# EAGLE design SparkFun_Pressure_Sensor_BMP581_Qwiic (EAGLE 9.6.2)
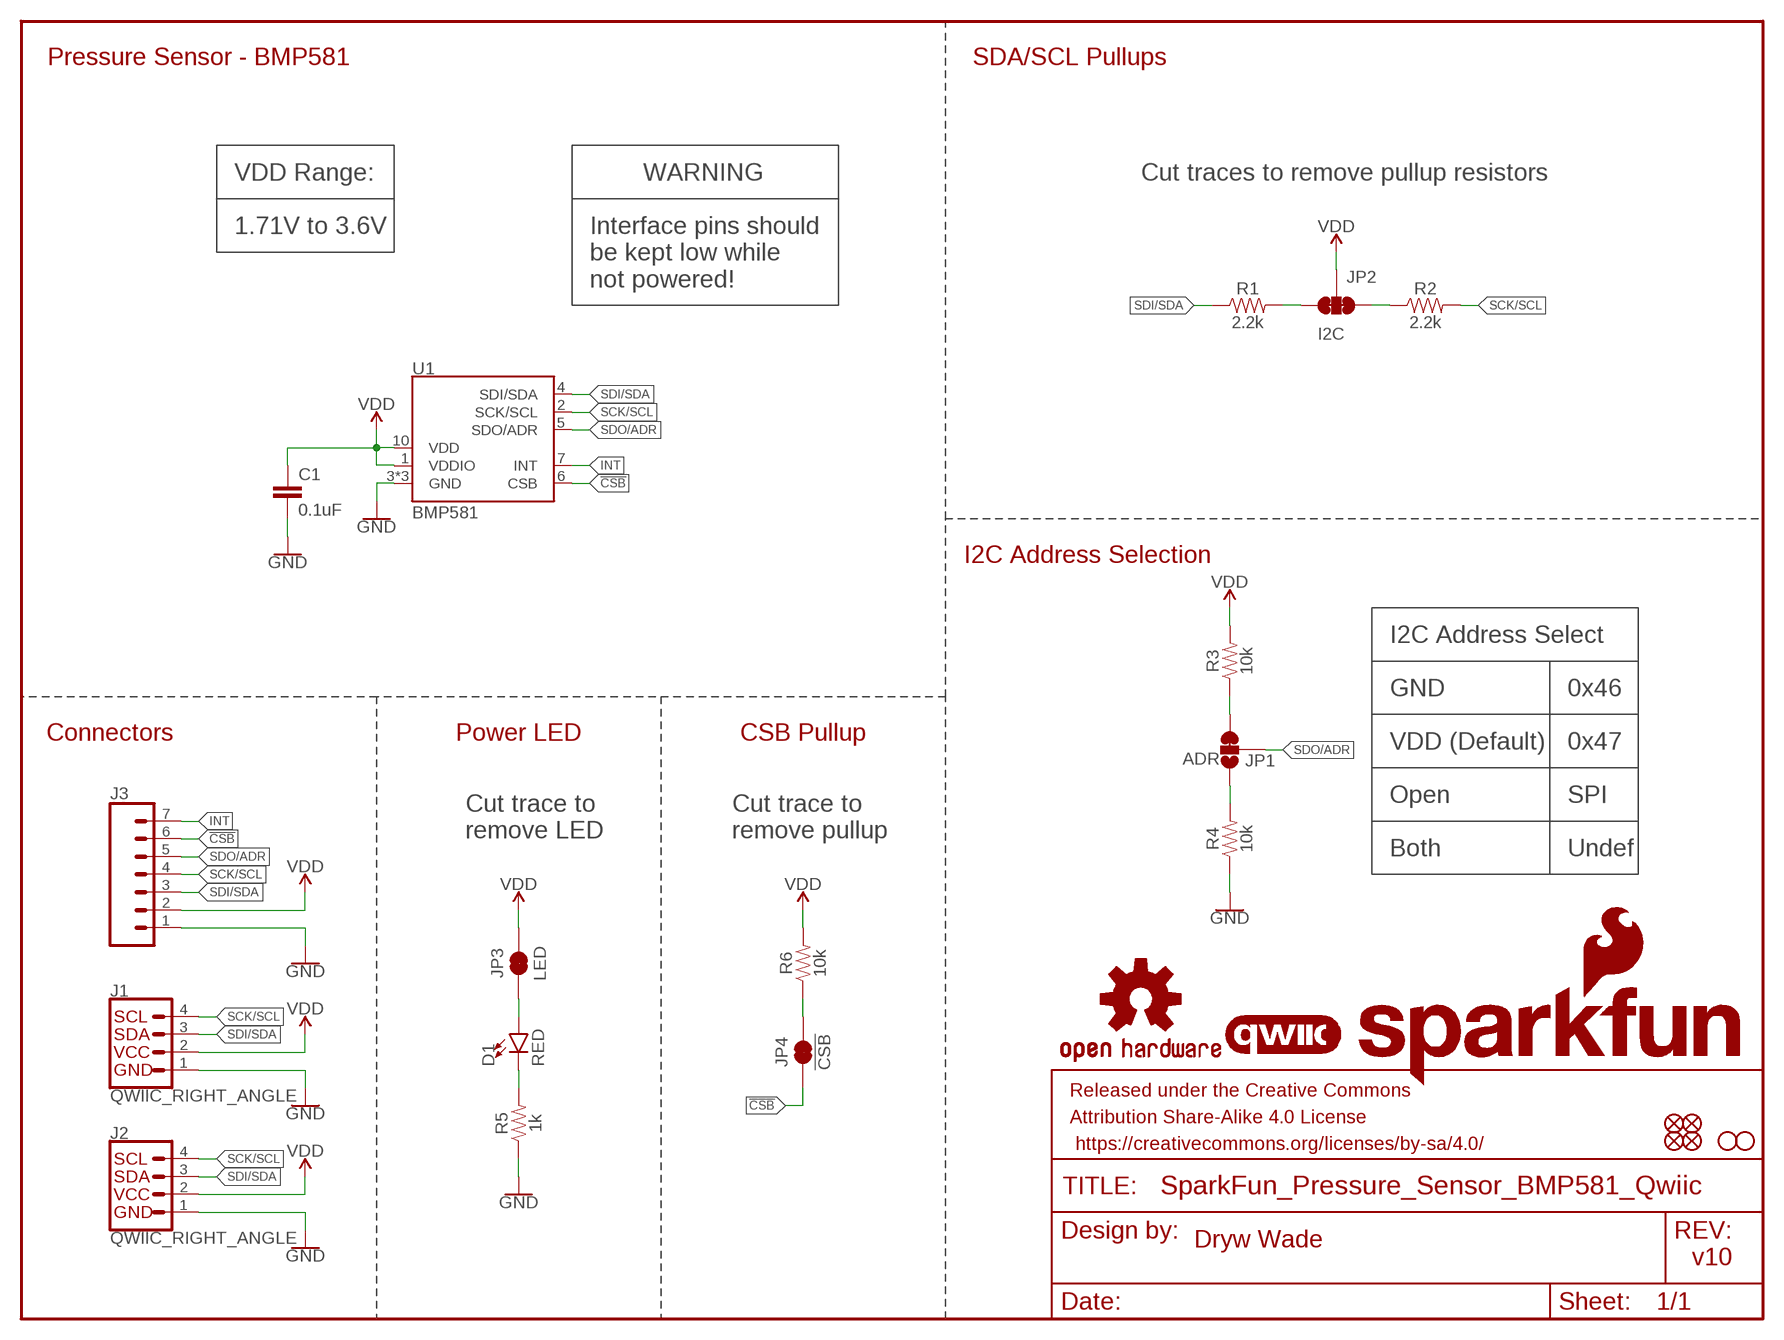
[diagram p0: schematic, sheet 1]

## Parts
C1  0.1uF  0.1UF-0603-25V-(+80/-20%)  [0603]
D1  RED  LED-RED0603  [LED-0603]
FD1  FIDUCIAL1X2  [FIDUCIAL-1X2]
FD2  FIDUCIAL1X2  [FIDUCIAL-1X2]
FD3  FIDUCIAL1X2  [FIDUCIAL-1X2]
FD4  FIDUCIAL1X2  [FIDUCIAL-1X2]
FRAME1  FRAME-LETTER  [CREATIVE_COMMONS]
H1  STAND-OFF  [STAND-OFF]
H2  STAND-OFF  [STAND-OFF]
J1  QWIIC_RIGHT_ANGLE  QWIIC_CONNECTORJS-1MM  [JST04_1MM_RA]
J2  QWIIC_RIGHT_ANGLE  QWIIC_CONNECTORJS-1MM  [JST04_1MM_RA]
J3  CONN_07NO_SILK  [1X07_NO_SILK]
JP1  ADR  JUMPER-SMT_3_1-NC_TRACE_SILK  [SMT-JUMPER_3_1-NC_TRACE_SILK]
JP2  I2C  JUMPER-SMT_3_2-NC_TRACE_SILK  [SMT-JUMPER_3_2-NC_TRACE_SILK]
JP3  LED  JUMPER-SMT_2_NC_TRACE_SILK  [SMT-JUMPER_2_NC_TRACE_SILK]
JP4  !CSB!  JUMPER-SMT_2_NC_TRACE_SILK  [SMT-JUMPER_2_NC_TRACE_SILK]
LOGO1  OSHW-LOGOS  [OSHW-LOGO-S]
LOGO2  SFE_LOGO_FLAME.2_INCH  [SFE_LOGO_FLAME_.2]
LOGO3  QWIIC_LOGO_5MM  [QWIIC_5MM]
LOGO4  SFE_LOGO_NAME_FLAME.1_INCH  [SFE_LOGO_NAME_FLAME_.1]
R1  2.2k  2.2KOHM-0603-1/10W-1%  [0603]
R2  2.2k  2.2KOHM-0603-1/10W-1%  [0603]
R3  10k  10KOHM-0603-1/10W-1%  [0603]
R4  10k  10KOHM-0603-1/10W-1%  [0603]
R5  1k  1KOHM-0603-1/10W-1%  [0603]
R6  10k  10KOHM-0603-1/10W-1%  [0603]
U1  BMP581  [BMP581]

## Nets
!CSB!: J3.6 JP4.1 U1.6(CSB)
GND: C1.2 J1.1 J2.1 J3.1 R4.1 R5.1 U1.3(GND) U1.8(GND) U1.9(GND)
INT: J3.7 U1.7(INT)
N$1: JP1.3 R3.1
N$2: JP1.1 R4.2
N$3: JP2.1 R2.1
N$4: JP2.3 R1.2
N$5: D1.A JP3.1
N$6: D1.C R5.2
N$7: JP4.2 R6.1
SCK/SCL: J1.4 J2.4 J3.4 R2.2 U1.2(SCK/SCL)
SDI/SDA: J1.3 J2.3 J3.3 R1.1 U1.4(SDI/SDA)
SDO/ADR: J3.5 JP1.2 U1.5(SDO/ADR)
VDD: C1.1 J1.2 J2.2 J3.2 JP2.2 JP3.2 R3.2 R6.2 U1.1(VDDIO) U1.10(VDD)

## Notes on the sheet
- Pressure Sensor - BMP581 | SDA/SCL Pullups
- VDD Range: | WARNING | Cut traces to remove pullup resistors
- 1.71V to 3.6V
- Interface pins should
  be kept low while
  not powered!
- I2C Address Selection
- I2C Address Select
- GND | 0x46
- Connectors | Power LED | CSB Pullup
- VDD (Default) | 0x47
- Open | SPI
- Cut trace to
  remove LED
- Cut trace to
  remove pullup
- Both | Undef
- Dryw Wade
- v10

## Library data of the parts
C1 = SparkFun-Capacitors:0.1UF: 0.1µF ceramic capacitors A capacitor is a passive two-terminal electrical component used to store electrical energy temporarily in an electric field.; PROD_ID: CAP-00810
D1 = SparkFun-LED:LED-RED: Red SMD LED Used in manufacturing of most products at SparkFun Packages: 0603 - SMD 0603 package [Product Link] <http://docs.avagotech.com/docs/AV02-0551EN> 0603 SMART - SMD 0603 SMART package ( more efficient and expensive)[Product Link] <http://www.osram-os.com/Graphics/XPic2/00077099_0.pdf> 1206 - SMD1206 package [Product Link] <https://www.sparkfun.com/datasheets/DevTools/LilyPad/Q150OVS4.pdff> SparkFun Products: Pro Mini 328 -5V <https://www.sparkfun.com/products/821> RedBoard <https://www.sparkfun.com/products/12757> IOIO-OTG <https://www.sparkfun.com/products/13613>; PROD_ID: DIO-00819
FD1-FD4 = SparkFun-Aesthetics:FIDUCIAL: Fiducial Alignment Points Point-of-reference for pick-and-place machines and other optical instruments.
FRAME1 = SparkFun-Aesthetics:FRAME-LETTER: Schematic Frame - Letter Standard 8.5x11 US Letter frame
H1 H2 = SparkFun-Hardware:STAND-OFF: Stand Off Drill holes for mechanically mounting via screws, standoffs, etc. Note: Use the keepout ring to avoid running the screw head into surrounding components. Variant Overviews STAND-OFF - Mechanical footprint for a #4 phillips button head screw. STAND-OFF-TIGHT - Mechanical footprint for a #4 phillips button head screw, Example SparkFun Products Screw - Phillips Head (1/4", 4-40, 10 pack) <https://www.sparkfun.com/products/10453> (PRT-10453) Screw - Phillips Head (1/2", 4-40, 10 pack) <https://www.sparkfun.com/products/10452> (PRT-10452) Screw - Phillips Head (3/4", 4-40, 10 pack) <https://www.sparkfun.com/products/10451> (PRT-10451) Screw - Phillips Head (1", 4-40, 10 pack) <https://www.sparkfun.com/products/10450> (PRT-10450)
J1 J2 = SparkFun-Connectors:QWIIC_CONNECTOR: SparkFun I2C Standard Qwiic Connector An SMD 1mm pitch JST connector makes it easy and quick (get it? Qwiic?) to connect I2C devices to each other. The Qwiic system <http://www.sparkfun.com/qwiic> enables fast and solderless connection between popular platforms and various sensors and actuators. We carry 200mm <https://www.sparkfun.com/products/14204>, 100mm <https://www.sparkfun.com/products/14205>, 50mm <https://www.sparkfun.com/products/14206>, and breadboard friendly <https://www.sparkfun.com/products/14207> Qwiic cables. We also offer 10 pcs strips <https://www.sparkfun.com/products/14323> the SMD connectors.; PROD_ID: CONN-13694
J3 = SparkFun-Connectors:CONN_07: Multi connection point. Often used as Generic Header-pin footprint for 0.1 inch spaced/style header connections On any of the 0.1 inch spaced packages, you can populate with these: Break Away Headers - Straight <https://www.sparkfun.com/products/116> (PRT-00116) Break Away Male Headers - Right Angle <https://www.sparkfun.com/products/553> (PRT-00553) Female Headers <https://www.sparkfun.com/products/115> (PRT-00115) Break Away Headers - Machine Pin <https://www.sparkfun.com/products/117> (PRT-00117) Break Away Female Headers - Swiss Machine Pin <https://www.sparkfun.com/products/743> (PRT-00743) For SCREWTERMINALS and SPRING TERMINALS visit here: Screw Terimnals on SparkFun.com <https://www.sparkfun.com/search/results?term=Screw+Terminals> (5mm/3.5mm/2.54mm spacing) This device is also useful as a general connection point to wire up your design to another part of your project. Our various solder wires solder well into these plated through hole pads. Hook-Up Wire - Assortment (Stranded, 22 AWG) <https://www.sparkfun.com/products/11375> (PRT-11375) Hook-Up Wire - Assortment (Solid Core, 22 AWG) <https://www.sparkfun.com/products/11367> (PRT-11367) View the entire wire category on our website here <https://www.sparkfun.com/categories/141> Special notes: Molex polarized connector foot print use with SKU : PRT-08231 with associated crimp pins and housings. 1MM SMD Version SKU: PRT-10208 NOTES ON THE VARIANTS LOCK and LOCK_LONGPADS... This footprint was designed to help hold the alignment of a through-hole component (i.e. 6-pin header) while soldering it into place. You may notice that each hole has been shifted either up or down by 0.005 of an inch from it's more standard position (which is a perfectly straight line). This slight alteration caused the pins (the squares in the middle) to touch the edges of the holes. Because they are alternating, it causes a "brace" to hold the component in place. 0.005 has proven to be the perfect amount of "off-center" position when using our standard breakaway headers. Although looks a little odd when you look at the bare footprint, once you have a header in there, the alteration is very hard to notice. Also,if you push a header all the way into place, it is covered up entirely on the bottom side.
JP1 = SparkFun-Jumpers:JUMPER-SMT_3_1-NC_TRACE: Normally closed trace jumper (1 of 2 connections) This jumper has a trace between two pads so it's normally closed (NC). The other connection is normally open (NO). Use a razor knife to open the connection. For best results follow the IPC guidelines for cutting traces: Cutout at least 0.063 mm (0.005 in). Remove all loose material to clean up the cut area. Seal the cut with an approved epoxy. Reapply solder to reclose the connection, or to close the NO connection.
JP2 = SparkFun-Jumpers:JUMPER-SMT_3_2-NC_TRACE: Normally closed trace jumper (2 of 2 connections) This jumper has a trace between all three pads so they are normally closed (NC). Use a razor knife to open the connection(s). For best results follow the IPC guidelines for cutting traces: Cutout at least 0.063 mm (0.005 in). Remove all loose material to clean up the cut area. Seal the cut with an approved epoxy. Reapply solder to reclose the connection(s).
JP3 JP4 = SparkFun-Jumpers:JUMPER-SMT_2_NC_TRACE: Normally closed trace jumper This jumper has a trace between two pads so it's normally closed (NC). Use a razor knife to open the connection. For best results follow the IPC guidelines for cutting traces: Cutout at least 0.063 mm (0.005 in). Remove all loose material to clean up the cut area. Seal the cut with an approved epoxy. Reapply solder to reclose the connection.
LOGO1 = SparkFun-Aesthetics:OSHW-LOGO: Open-Source Hardware (OSHW) Logo This logo indicates the piece of hardware it is found on incorporates a OSHW license and/or adheres to the definition of open source hardware found here: http://freedomdefined.org/OSHW
LOGO2 = SparkFun-Aesthetics:SFE_LOGO_FLAME: SparkFun Flame Logo This is the SparkFun flame logo. The logo on the schematic will always be the same size; the package variant is the height of the flame. Default layer for the logo on the board is tSilk.
LOGO3 = SparkFun-Aesthetics:QWIIC_LOGO: Qwiic Logos for placement on schematic and PCB. The 5.5mm silk logo is best for placing next to Qwiic connector.
LOGO4 = SparkFun-Aesthetics:SFE_LOGO_NAME_FLAME: SparkFun Font Logo w/ Flame This is the SparkFun full logo. The logo on the schematic will always be the same size; the package variant is the height of the flame part of the logo. Default layer for the logo on the board is tSilk.
R1 R2 = SparkFun-Resistors:2.2KOHM: 2.2kΩ resistor A resistor is a passive two-terminal electrical component that implements electrical resistance as a circuit element. Resistors act to reduce current flow, and, at the same time, act to lower voltage levels within circuits. - Wikipedia; PROD_ID: RES-08272
R3 R4 R6 = SparkFun-Resistors:10KOHM: 10kΩ resistor A resistor is a passive two-terminal electrical component that implements electrical resistance as a circuit element. Resistors act to reduce current flow, and, at the same time, act to lower voltage levels within circuits. - Wikipedia; PROD_ID: RES-00824
R5 = SparkFun-Resistors:1KOHM: 1kΩ resistor A resistor is a passive two-terminal electrical component that implements electrical resistance as a circuit element. Resistors act to reduce current flow, and, at the same time, act to lower voltage levels within circuits. - Wikipedia; PROD_ID: RES-07856
U1 = SparkFun-Sensors:BMP581: Bosch BMP581 Pressure Sensor Senses pressure from 300 hPa to 1250 hPa, sends data out over I2C or SPI; PROD_ID: IC-16798

## Board
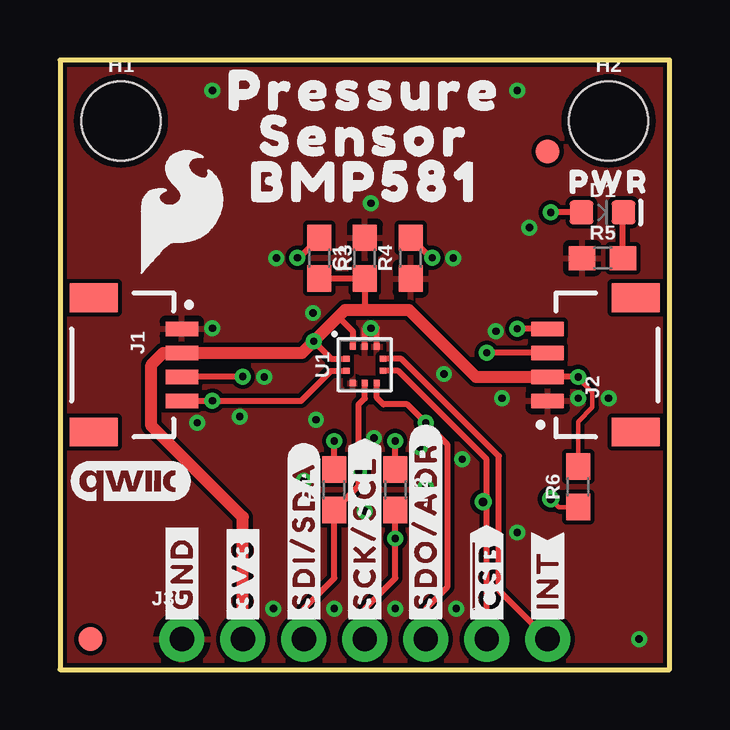
[diagram p1: board, top side]
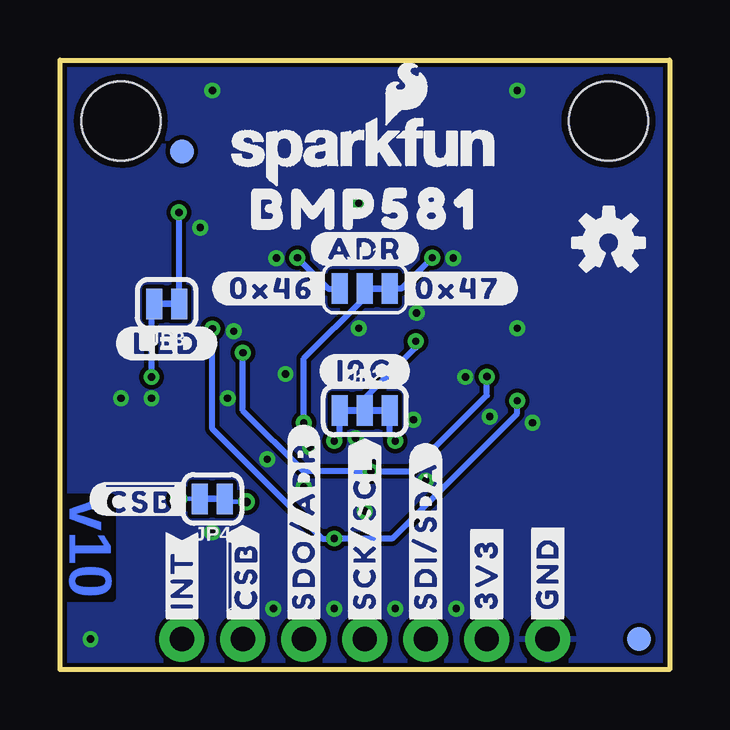
[diagram p2: board, bottom side, seen from below]

Size 25.4 x 25.4 mm. Coordinates in mm from the lower left corner, seen from the top.
Outline: 0,0 25.4,0 25.4,25.4 0,25.4 0,0
Copper layers (1*16): Top 0.035mm / dielectric 1.5mm / Bottom 0.035mm
Design rules "SparkFun-2-Layer-General-JLCPCB": minimum track width 7mil, minimum drill 0.3mm, track to track 7mil, track to pad 7mil, pad to pad 7mil, via to via 7mil, smd to smd 7mil, copper to edge 7mil, drill to drill 7mil, minimum pad ring 7mil, minimum via ring 7mil, stop-mask expansion 3mil, vias tented up to drill 25mil, thermal gap 10mil
tRestrict: area 11.8,11.8 to 11.9,12.1; area 13.5,13.3 to 13.6,13.6; area 12.8,13.3 to 13,13.6

### Footprints (pad centres in the part's own frame; a part is rotated, then mirrored left to right if it is on the bottom)
0603 = smd 1.1 x 1: 1 -0.85,0; 2 0.85,0
LED-0603 = smd 1 x 1: A -0.877,0; C 0.877,0
FIDUCIAL-1X2 = smd 1 x 1: 1 0,0
STAND-OFF = hole 3.302: 0,0
JST04_1MM_RA = smd 0.6 x 1.35: 1 -1.5,0; 2 -0.5,0; 3 0.5,0; 4 1.5,0 | smd 1.2 x 2: NC1 2.8,-3.675; NC2 -2.8,-3.675
1X07_NO_SILK = drill 1.016 pad 1.88: 1 0,0; 2 2.54,0; 3 5.08,0; 4 7.62,0; 5 10.16,0; 6 12.7,0; 7 15.24,0
SMT-JUMPER_3_1-NC_TRACE_SILK = smd 0.66 x 1.27: 1 -1.041,0; 2 0,0; 3 1.041,0
SMT-JUMPER_3_2-NC_TRACE_SILK = smd 0.66 x 1.27: 1 -1.041,0; 2 0,0; 3 1.041,0
SMT-JUMPER_2_NC_TRACE_SILK = smd 0.66 x 1.27: 1 -0.521,0; 2 0.521,0
BMP581 = smd 0.25 x 0.275: 1 0.25,0.762; 2 -0.25,0.762; 6 -0.25,-0.762; 7 0.25,-0.762 | smd 0.275 x 0.25: 3 -0.762,0.5; 4 -0.762,0; 5 -0.762,-0.5; 8 0.762,-0.5; 9 0.762,0; 10 0.762,0.5

### Placement (x,y rotation side)
C1  12.7,17.14 90 top
D1  22.61,19.05 0 top
FD1  20.32,21.59 0 bottom
FD2  20.32,21.59 0 top
FD3  1.27,1.27 0 bottom
FD4  1.27,1.27 0 top
FRAME1  -10.16,-21.59 0 top  (outside the outline)
H1  2.54,22.86 0 top
H2  22.86,22.86 0 top
J1  5.08,12.7 270 top
J2  20.32,12.7 90 top
J3  5.08,1.27 0 top
JP1  12.7,15.88 0 bottom
JP2  12.7,10.79 0 bottom
JP3  20.95,15.24 180 bottom
JP4  19.05,7.11 180 bottom
LOGO1  2.54,17.78 0 bottom
LOGO2  5.08,19.05 0 top
LOGO3  2.92,7.87 0 top
LOGO4  12.7,21.59 0 bottom
R1  11.43,7.49 90 top
R2  13.97,7.49 270 top
R3  10.79,17.14 270 top
R4  14.61,17.14 90 top
R5  22.61,17.14 0 top
R6  21.59,7.62 90 top
U1  12.7,12.7 90 top
U$1  [BMP5810]  12.7,20.32 0 top
U$2  [#GND#0]  5.08,1.78 90 top
U$3  [#GND#0]  5.08,1.78 90 bottom
U$4  [#3V3#0]  7.62,1.78 90 bottom
U$5  [#SDI#SDA#0]  10.16,1.78 90 top
U$6  [#SDI#SDA#0]  10.16,1.78 90 bottom
U$7  [#SCK#SCL#0]  12.7,1.78 90 top
U$8  [#SCK#SCL#0]  12.7,1.78 90 bottom
U$9  [#SDO#ADR#0]  15.24,1.78 90 top
U$10  [#SDO#ADR#0]  15.24,1.78 90 bottom
U$11  [#I2C#0]  12.7,12.45 0 bottom
U$12  [#0X46#0]  14.1,15.88 0 bottom
U$13  [#INT#0]  20.32,1.78 90 top
U$14  [#INT#0]  20.32,1.78 90 bottom
U$15  [#0X47#0]  11.3,15.88 0 bottom
U$16  [PWR0]  22.86,20.32 0 top
U$17  [#ADR#0]  12.7,17.53 0 bottom
U$18  [##CSB##1]  19.94,7.11 0 bottom
U$19  [#LED#0]  20.95,13.59 0 bottom
U$20  [#3V3#0]  7.62,1.78 90 top
U$21  [PRESSURE0]  12.7,24.13 0 top
U$22  [BMP5810]  12.7,19.18 0 bottom
U$25  [##CSB##0]  17.78,1.78 90 top
U$26  [SENSOR0]  12.7,22.23 0 top
U$28  [##CSB##0]  17.78,1.78 90 bottom

### Tracks (layer width: path | path; a pad name or v marks a point on that pad's centre or on a via)
!CSB!  (via drill 0.35)
  Top 0.178: v17.63,6.99 17.78,6.99
  Top 0.254: J3.6 17.78,6.99 17.78,8.76 14.09,12.45 U1.6
  Bottom 0.178: JP4.1 18.4,6.99 v17.63,6.99
GND  (via drill 0.3)
  Top 0.254: U1.9 12.7,14.22 v12.95,14.22 13.2,14.22 U1.8
  other vias: 11.43,2.54 13.97,2.54 16.51,2.54 24.13,1.27 19.05,24.13 6.35,24.13 12.95,19.43 10.67,10.41 8.89,2.54 5.71,10.29 6.35,14.22 21.59,11.3 16,12.32 10.16,7.87 16.76,8.76 18.41,11.3 16.38,17.14 10.54,14.86 13.08,9.65 8.51,12.19 18.16,14.1 7.49,10.54 12.7,6.6 19.56,18.41 9.02,17.14 15.24,7.62 14.99,9.27 22.86,11.3 19.05,5.71
  pour Top: 0,0 25.4,0 25.4,25.4 0,25.4
  pour Bottom: 0,0 25.4,0 25.4,25.4 0,25.4
INT
  Top 0.254: J3.7 18.29,3.3 18.29,8.89 14.23,12.95 U1.7
N$1  (via drill 0.3)
  Top 0.254: R3.1 9.96,17.16 v9.89,17.16
  Bottom 0.254: v9.89,17.16 11.18,15.88 JP1.3
N$2  (via drill 0.3)
  Top 0.254: R4.2 15.44,17.16 v15.51,17.16
  Bottom 0.254: v15.51,17.16 14.22,15.88 JP1.1
N$3  (via drill 0.3)
  Top 0.254: R2.1 v13.97,9.53
  Bottom 0.254: v13.97,9.53 13.74,9.75 JP2.1
N$4  (via drill 0.3)
  Top 0.254: R1.2 v11.43,9.53
  Bottom 0.254: v11.43,9.53 11.66,9.75 JP2.3
N$5  (via drill 0.3)
  Top 0.254: D1.A v20.45,19.05
  Bottom 0.254: v20.45,19.05 20.45,15.25 JP3.1
N$6
  Top 0.254: R5.2 23.46,19.02 D1.C
N$7  (via drill 0.35)
  Top 0.178: v20.45,7.11 20.79,6.77 R6.1
  Bottom 0.178: JP4.2 v20.45,7.11
SCK/SCL  (via drill 0.3)
  Top 0.254: J3.4 12.7,2.54 13.97,3.81 v13.97,5.46 R2.2 | J1.4 v6.35,11.2 10.04,11.2 11.29,12.45 U1.2 | J2.4 v19.05,14.2
  Bottom 0.254: v6.35,11.2 6.35,10.67 11.56,5.46 v13.97,5.46 14.48,5.46 19.05,10.03 v19.05,14.2
SDI/SDA  (via drill 0.3)
  Top 0.254: J3.3 10.16,2.54 11.43,3.81 R1.1 12.45,7.66 v12.45,8.26 12.45,11.05 12.7,11.3 U1.4 | J2.3 v17.78,13.2 | v7.61,12.21 J1.3
  Bottom 0.254: v17.78,13.2 17.78,10.79 15.25,8.26 v12.45,8.26 10.79,8.26 7.61,11.43 v7.61,12.21
SDO/ADR  (via drill 0.3)
  Top 0.254: J3.5 15.24,2.54 16.13,3.43 16.13,9.4 v15.24,10.29 14.48,11.05 13.47,11.05 13.2,11.32 U1.5
  Bottom 0.254: v15.24,10.29 15.24,12.96 12.7,15.5 JP1.2
VDD  (via drill 0.3)
  Top 0.178: R6.2 21.59,10.33 22.19,10.93 22.19,11.55 21.59,12.15 v21.59,12.19
  Top 0.254: 12.7,14.99 C1.1 R3.2 | v21.59,12.19 J2.2 | U1.10 12.2,14.09 11.59,14.7 | U1.1 11.31,12.95 v10.57,13.68
  Top 0.508: J2.2 17.33,12.2 14.54,14.99 12.7,14.99 11.88,14.99 11.59,14.7 v10.57,13.68 10.09,13.2 J1.2 4.31,13.2 3.81,12.7 3.81,10.16 7.62,6.35 J3.2
  Bottom 0.254: JP3.2 21.59,15.13 v21.59,12.19 | JP2.2 12.7,11.3 10.57,13.43 v10.57,13.68

### Text on the board
Bottom: v10
Measures: Units: inches
tDocu: Dryw Wade